# Altium project X4SIP02.PrjPcb
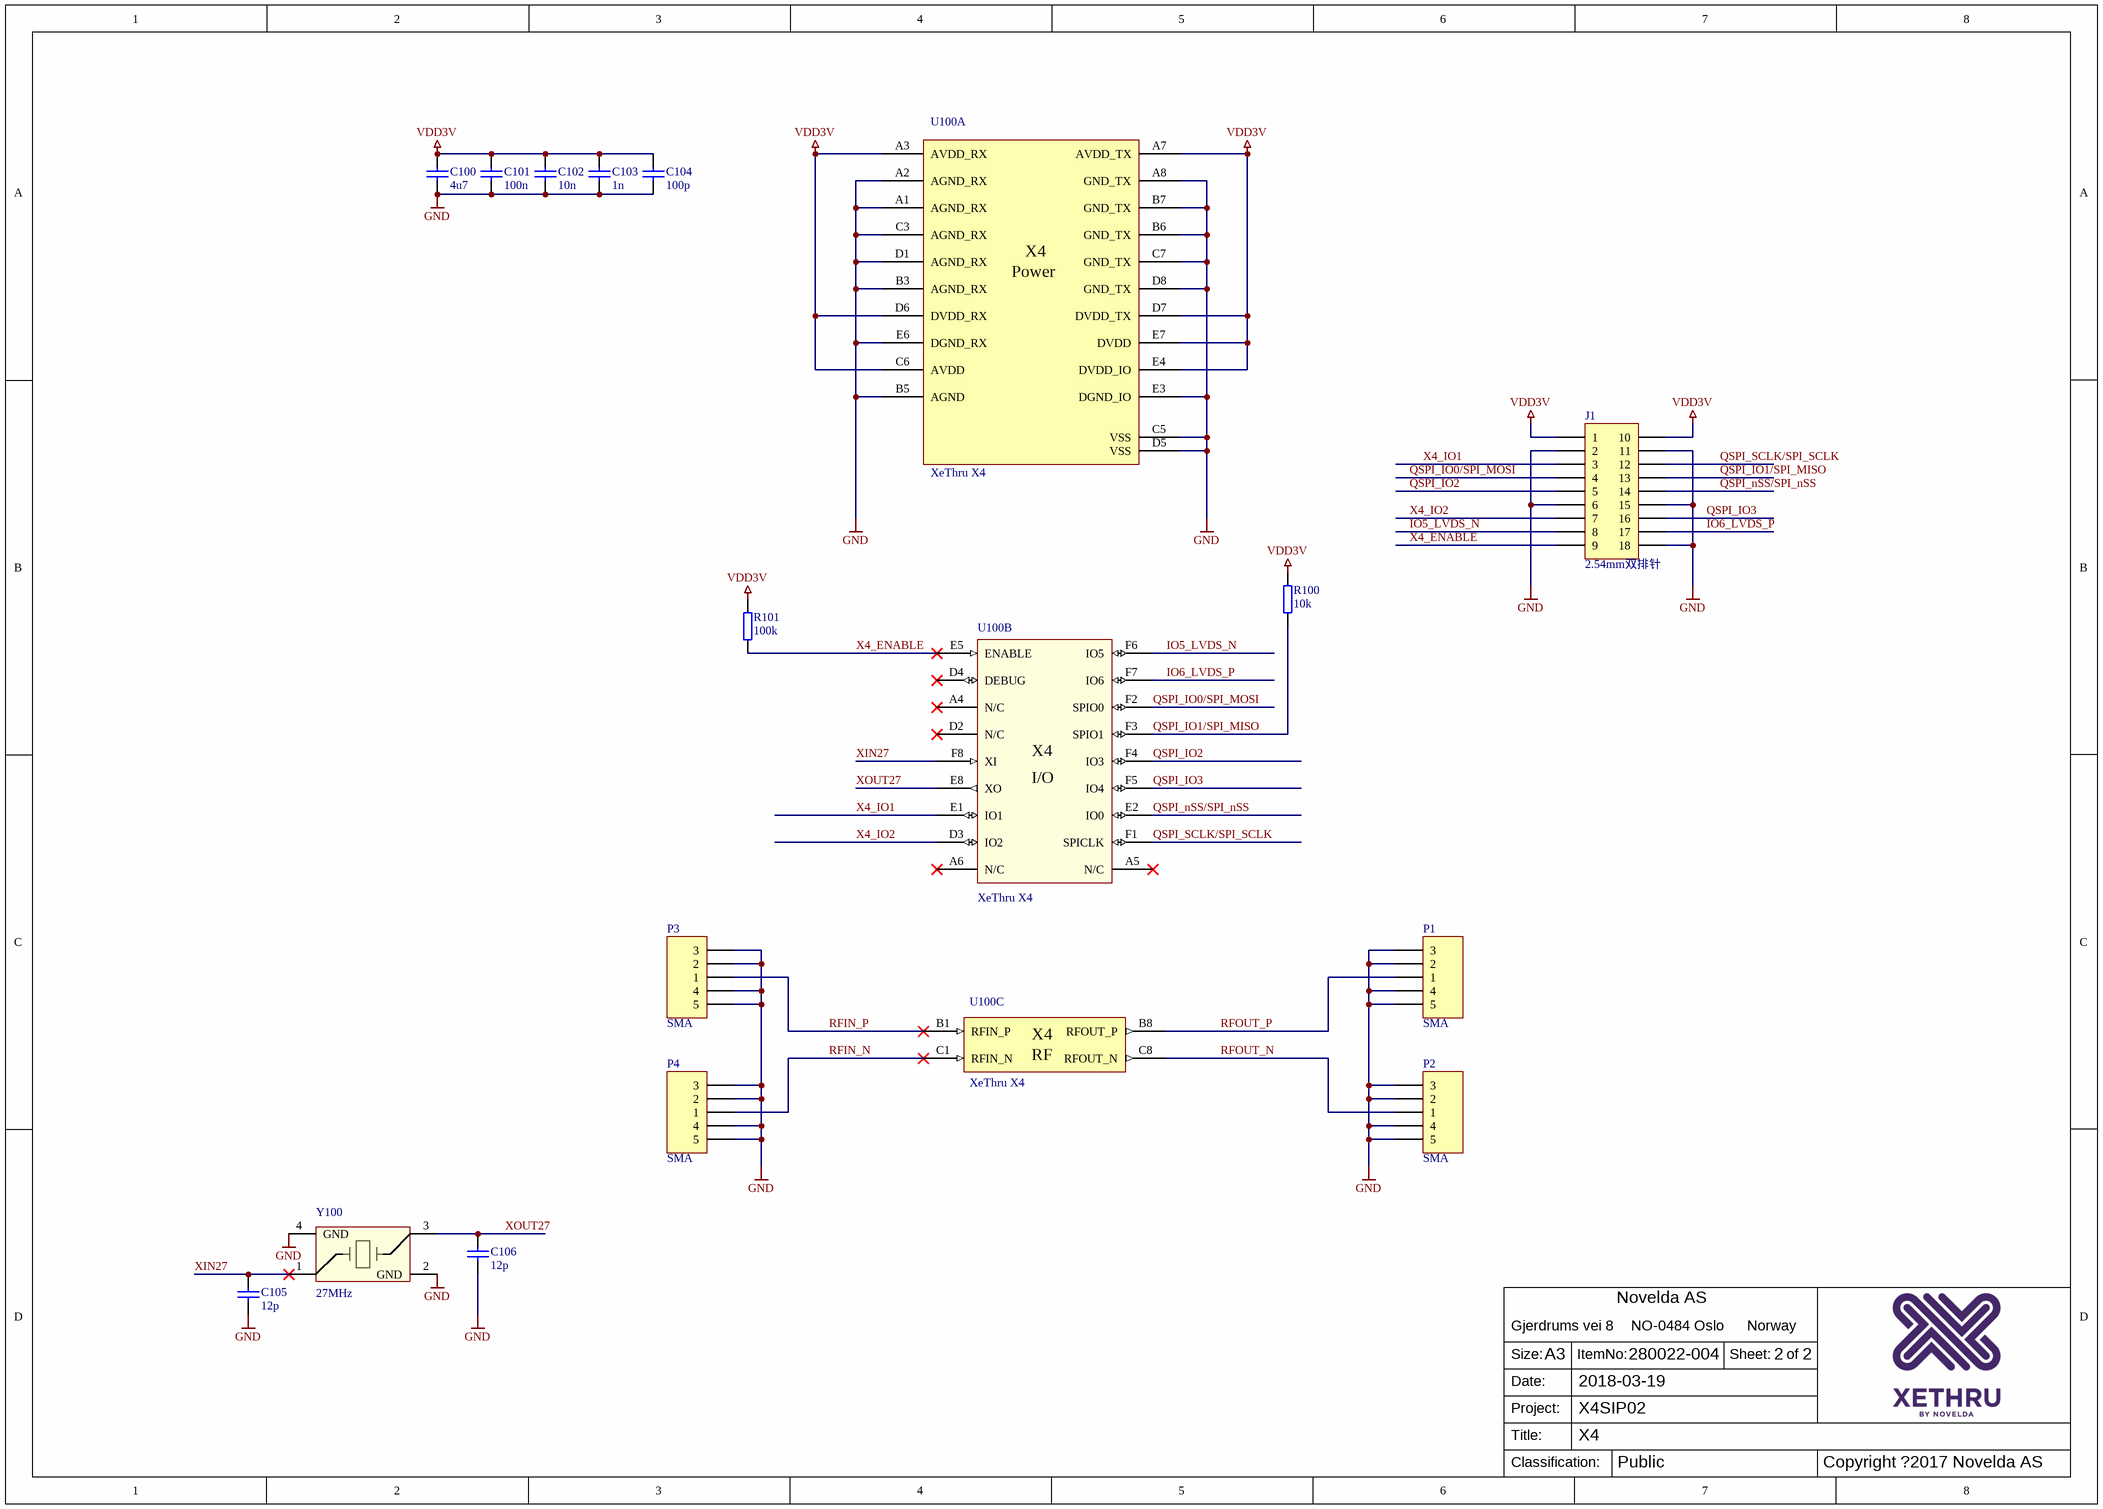
[diagram p0: X4.SchDoc]
PCB_Classification: Public; PCB_Date: 2018-03-19; PCB_ItemNo: 290047-004; PCBA_Classification: Public; PCBA_Date: 2018-03-19; PCBA_Description: X4 Radar Module - System in Package with only X4 and related components; PCBA_ItemNo: 280022-004; PCBA_ProjectName: X4SIP02
1 sheet, 16 parts. Net scope: global (net labels, ports and power ports of the same name join across sheets).
Board file: PCB1.PcbDoc

## Sheet X4.SchDoc: X4
size A3; CompanyName: Novelda AS; Organization: Novelda AS; Address1: Gjerdrums vei 8; Address2: NO-0484 Oslo; Address3: Norway; Revision: 1.A; SheetNumber: 2; SheetTotal: 2; Classification: Public; Size: A3; Project: X4M01; ProjectName: Prosject Name

### Parts
C100  4u7  [0603-CAPACITOR-NONPOL]
C101  100n  [0402-CAPACITOR-NONPOL]
C102  10n  [0402-CAPACITOR-NONPOL]
C103  1n  [0402-CAPACITOR-NONPOL]
C104  100p  [0402-CAPACITOR-NONPOL]
C105  12p  [0402-CAPACITOR-NONPOL]
C106  12p  [0402-CAPACITOR-NONPOL]
J1  2.54mm双排针  [HDR2X9_CEN]
P1  SMA  [SMD3]
P2  SMA  [SMD3]
P3  SMA  [SMD3]
P4  SMA  [SMD3]
R100  10k  [0402-RESISTOR]
R101  100k  [0402-RESISTOR]
U100  XeThru X4  [200106-002]  (parts A,B,C of 3)
Y100  27MHz  [200281]

### Nets
GND: C100.2 C101.2 C102.2 C103.2 C104.2 C105.2 C106.2 J1.2 J1.6 J1.11 J1.15 J1.18 P1.2 P1.3 P1.4 P1.5 P2.2 P2.3 P2.4 P2.5 P3.2 P3.3 P3.4 P3.5 P4.2 P4.3 P4.4 P4.5 U100.A1(AGND_RX) U100.A2(AGND_RX) U100.A8(GND_TX) U100.B3(AGND_RX) U100.B5(AGND) U100.B6(GND_TX) U100.B7(GND_TX) U100.C3(AGND_RX) U100.C5(VSS) U100.C7(GND_TX) U100.D1(AGND_RX) U100.D5(VSS) U100.D8(GND_TX) U100.E3(DGND_IO) U100.E6(DGND_RX) Y100.2(GND) Y100.4(GND)
VDD3V: C100.1 C101.1 C102.1 C103.1 C104.1 J1.1 J1.10 R100.2 R101.2 U100.A3(AVDD_RX) U100.A7(AVDD_TX) U100.C6(AVDD) U100.D6(DVDD_RX) U100.D7(DVDD_TX) U100.E4(DVDD_IO) U100.E7(DVDD)
IO5_LVDS_N: J1.8 U100.F6(IO5)
IO6_LVDS_P: J1.17 U100.F7(IO6)
QSPI_IO0/SPI_MOSI: J1.4 U100.F2(SPIO0)
QSPI_IO1/SPI_MISO: J1.13 R100.1 U100.F3(SPIO1)
QSPI_IO2: J1.5 U100.F4(IO3)
QSPI_IO3: J1.16 U100.F5(IO4)
QSPI_nSS/SPI_nSS: J1.14 U100.E2(IO0)
QSPI_SCLK/SPI_SCLK: J1.12 U100.F1(SPICLK)
RFIN_N: P4.1 U100.C1(RFIN_N)
RFIN_P: P3.1 U100.B1(RFIN_P)
RFOUT_N: P2.1 U100.C8(RFOUT_N)
RFOUT_P: P1.1 U100.B8(RFOUT_P)
X4_ENABLE: J1.9 R101.1 U100.E5(ENABLE)
X4_IO1: J1.3 U100.E1(IO1)
X4_IO2: J1.7 U100.D3(IO2)
XIN27: C105.1 U100.F8(XI) Y100.1
XOUT27: C106.1 U100.E8(XO) Y100.3

Not connected (* = marked no-connect by the designer): U100 A4(N/C)* A5(N/C)* A6(N/C)* D2(N/C)* D4(DEBUG)*

### Notes on the sheet
- Size:
- Date:
- ItemNo:
- Sheet:
- of
- Title:
- Project:
- Classification:
- Copyright ?2017 Novelda AS
- (in symbol 200260-002, part A) X4; Power
- (in symbol 200260-002, part B) X4; I/O
- (in symbol 200260-002, part C) X4; RF

### Library data of the parts
C100 = 200128: CAPACITOR, 4u7, 0603, 10%, 10V, X5R; ItemNo: 200128; Component Status: Active; Value: 4u7; Component Category: Capacitor; Manufacturer: --; ClassName: -; Notes: -; Supplier: Farnell Norge; SupplierCatNo: 2320818
C101 = 200010: CAPACITOR, 100n, 0402, 10%, 10V, X5R; ItemNo: 200010; Component Status: Active; Value: 100n; Component Category: Capacitor; Manufacturer: --; Supplier: Farnell Norge; SupplierCatNo: 1759380
C102 = 200005: CAPACITOR, 10n, 0402, 10%, 25V, X7R; ItemNo: 200005; Component Status: Active; Value: 10n; Component Category: Capacitor; Manufacturer: --; Supplier: Farnell Norge; SupplierCatNo: 1758924
C103 = 200205: CAPACITOR, 1n, 0402, 10%, 25V, X7R; ItemNo: 200205; Component Status: Active; Value: 1n; Component Category: Capacitor; Manufacturer: --; ClassName: -; Notes: -; Supplier: Farnell Norge; SupplierCatNo: 1758911
C104 = 200107: CAPACITOR, 100p, 0402, 20%, 50V, X7R; ItemNo: 200107; Component Status: New; Value: 100p; Component Category: Capacitor; Manufacturer: --; ClassName: -; Notes: -; Supplier: Farnell Norge; SupplierCatNo: 1709605
C105 C106 = 200239: CAPACITOR, 12p, 0402, 5%, 50V, NP0; ItemNo: 200239; Component Status: New; Value: 12p; Component Category: Capacitor; Manufacturer: --; ClassName: -; Notes: -; Supplier: Farnell Norge; SupplierCatNo: 1758943
J1 = Header 9X2A: Header, 9-Pin, Dual row; LatestRevisionDate: 17-Jul-2002; LatestRevisionNote: Re-released for DXP Platform.; Publisher: Altium Limited
P1-P4 = Header 5: Header, 5-Pin; LatestRevisionDate: 17-Jul-2002; LatestRevisionNote: Re-released for DXP Platform.; Publisher: Altium Limited
R100 = 200026: RESISTOR, 10k, 0402, 1%, 63mW; ItemNo: 200026; Component Status: Active; Value: 10k; Component Category: Resistor; Manufacturer: --; Supplier: Farnell Norge; SupplierCatNo: 2331444
R101 = 200027: RESISTOR, 100k, 0402, 1%, 63mW; ItemNo: 200027; Component Status: Active; Value: 100k; Component Category: Resistor; Manufacturer: --; Supplier: Farnell Norge; SupplierCatNo: 9239472
U100 = 200260-002: Manufacturer: Novelda; Component Status: New; Component Category: Novelda IC; ItemNo: 200260-002; Value: XeThru X4; MPN: 200260-002; ClassName: -; Notes: -
Y100 = 200281: LFXTAL072115, CRYSTAL 27MHZ, 10PF, SMD; Manufacturer: IQD Frequency Products; Component Status: New; ItemNo: 200281; Value: 27MHz; Component Category: Crystal; MPN: LFXTAL072115; ClassName: -; Notes: -; Supplier: IQD Frequency Products Ltd; SupplierCatNo: LFXTAL072115

## Assembly variants
Populated_Components: all parts fitted